# Altium schematic sheet BPBE Module.SchDoc
size C
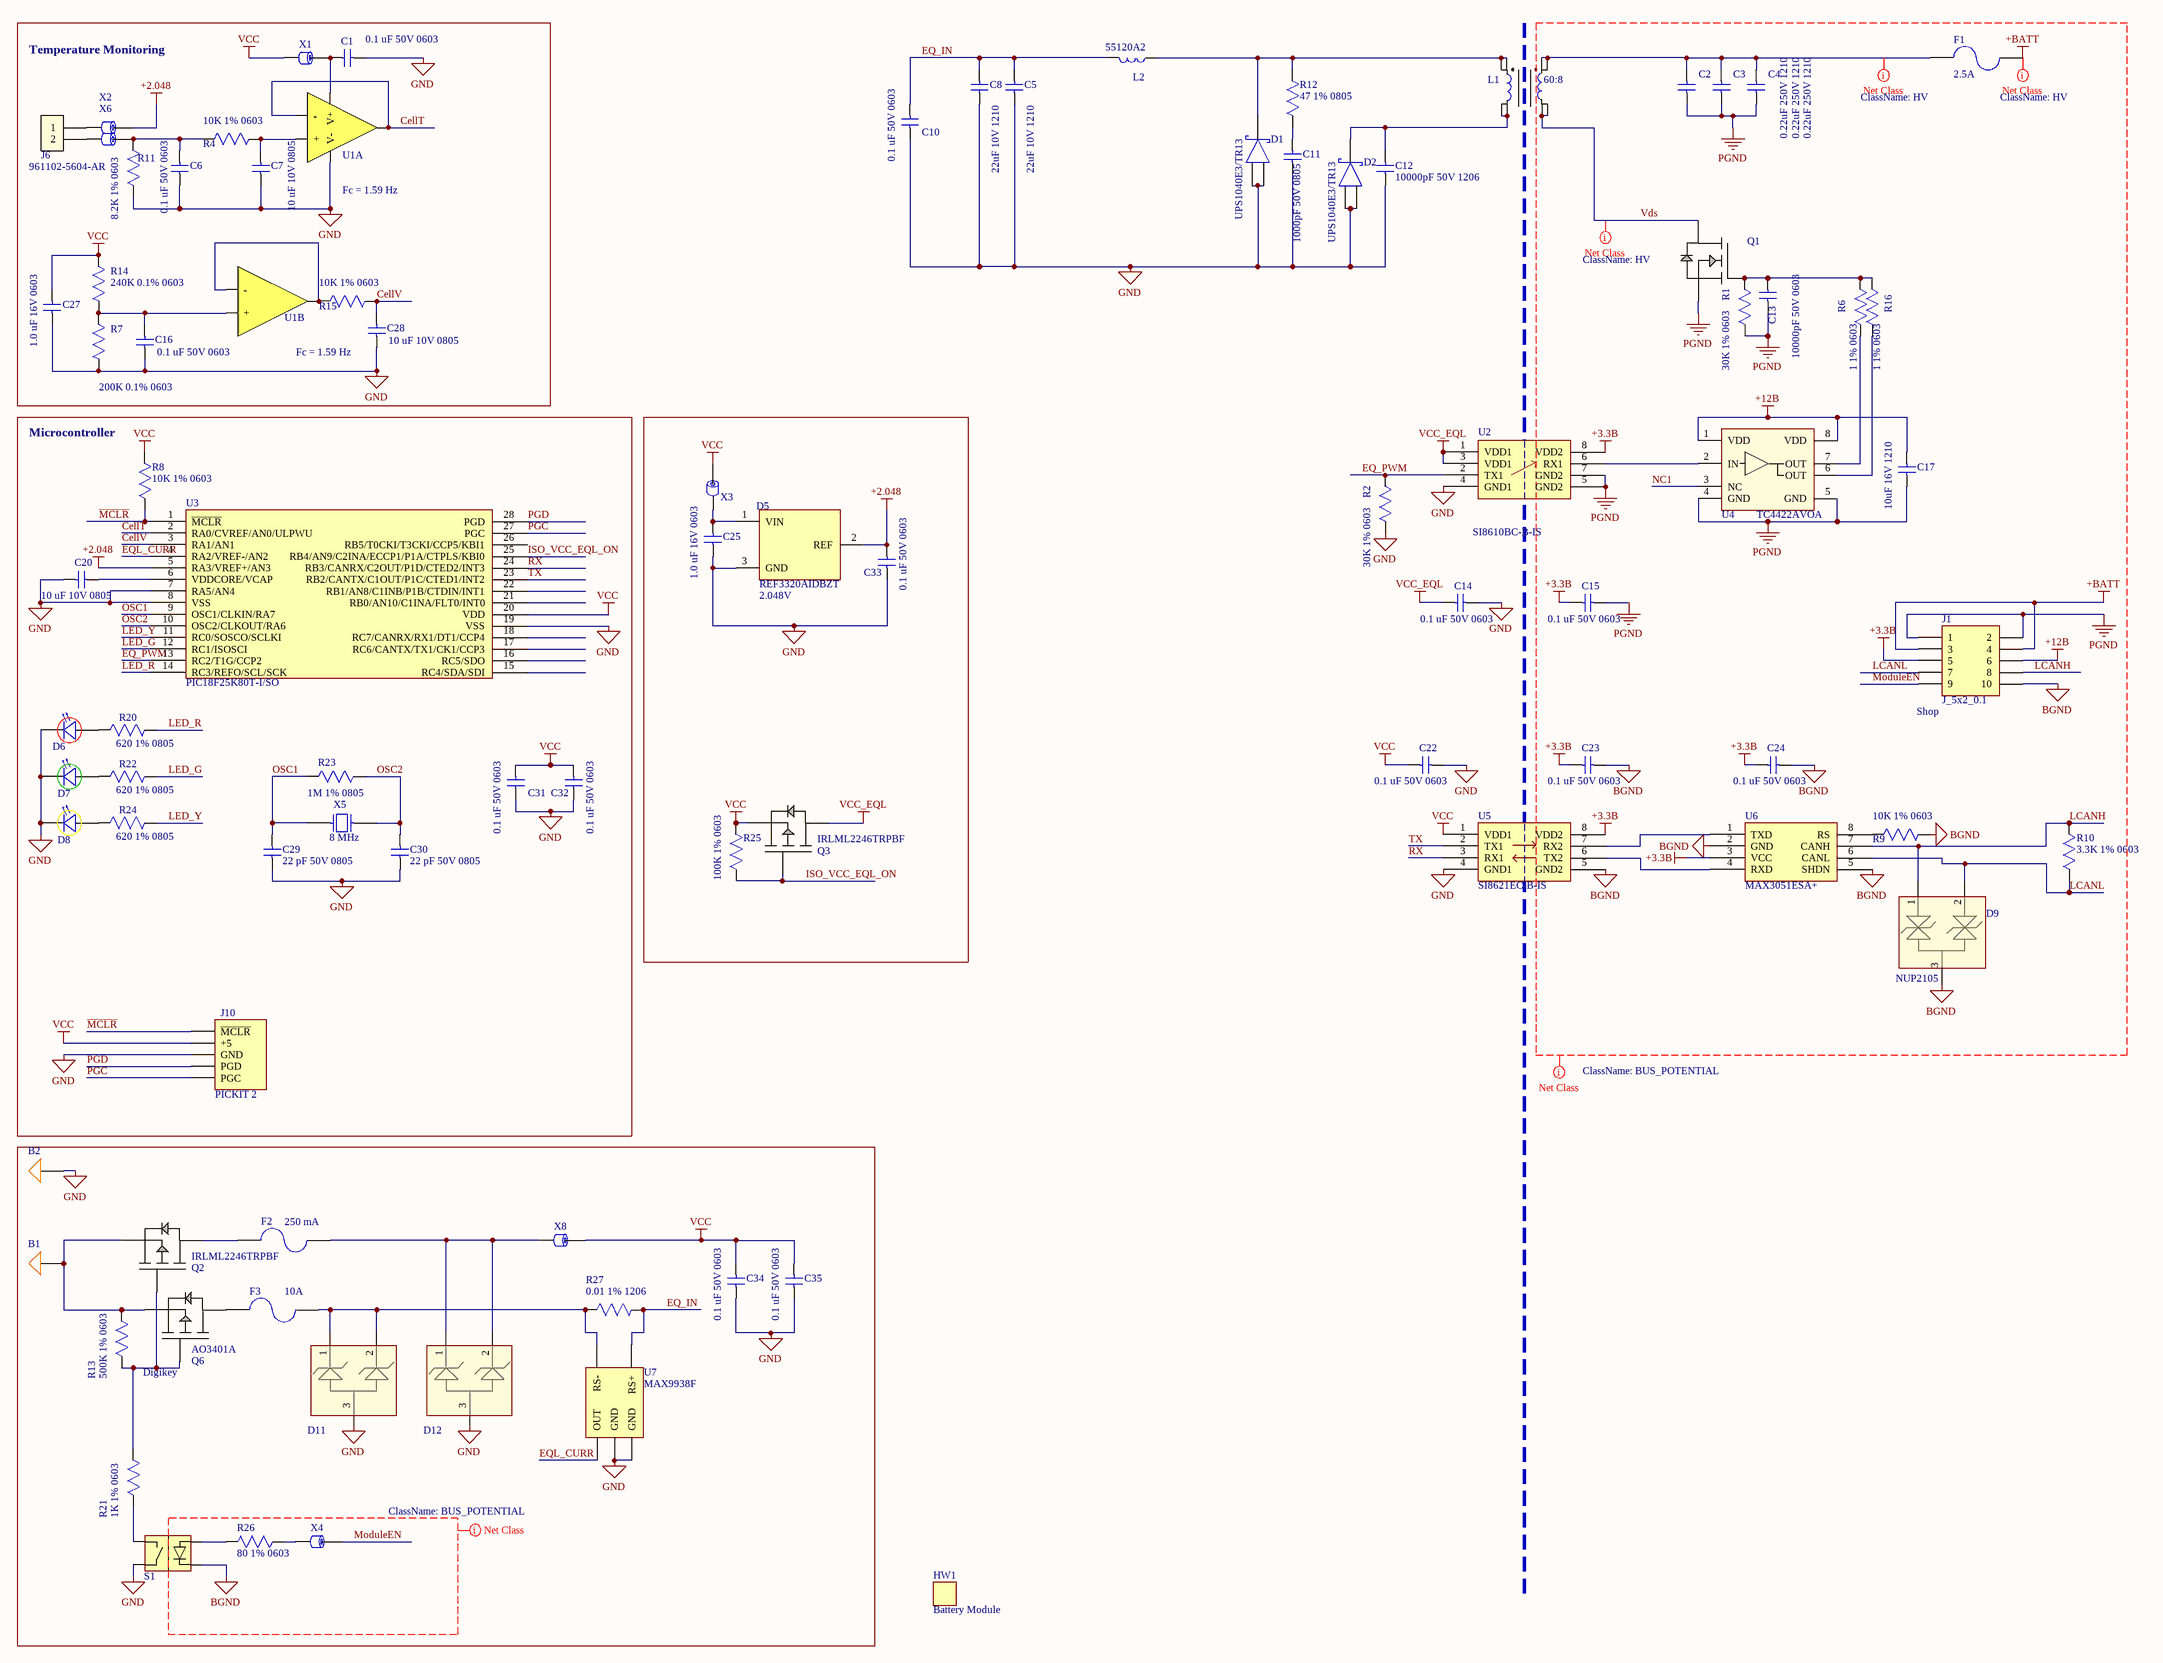
[diagram p0: BPBE Module.SchDoc]

## Parts
B1  J_C3_BATTERY_PAD  [BatteryPad]  (value not drawn)
B2  J_C3_BATTERY_PAD  [BatteryPad]  (value not drawn)
C1  value 0.1 uF 50V 0603  [0603_cap]  (hidden comment: CAP 0603)
C2  value 0.22uF 250V 1210  [1210_Capacitor]  (hidden comment: CAP 1210)
C3  value 0.22uF 250V 1210  [1210_Capacitor]  (hidden comment: CAP CER 0.22UF 250V 20% X7R 1210)
C4  value 0.22uF 250V 1210  [1210_Capacitor]  (hidden comment: CAP 1210)
C5  value 22uF 10V 1210  [1210_Capacitor]  (hidden comment: CAP 1210)
C6  value 0.1 uF 50V 0603  [0603_cap]  (hidden comment: CAP 0603)
C7  value 10 uF 10V 0805  [0805_Capacitor]  (hidden comment: CAP 0805)
C8  value 22uF 10V 1210  [1210_Capacitor]  (hidden comment: CAP 1210)
C10  value 0.1 uF 50V 0603  [0603_cap]  (hidden comment: CAP 0603)
C11  value 1000pF 50V 0805  [0805_Capacitor]  (hidden comment: CAP 1000pF)
C12  value 10000pF 50V 1206  [1206_CAPACITOR]  (hidden comment: CAP 1206)
C13  value 10000pF 50V 0603  [0603_cap]  (hidden comment: CAP 0603)
C14  value 0.1 uF 50V 0603  [0603_cap]  (hidden comment: CAP 0603)
C15  value 0.1 uF 50V 0603  [0603_cap]  (hidden comment: CAP 0603)
C16  value 0.1 uF 50V 0603  [0603_cap]  (hidden comment: CAP 0603)
C17  value 10uF 16V 1210  [1210_Capacitor]  (hidden comment: CAP 1210)
C20  value 10 uF 10V 0805  [0805_Capacitor]  (hidden comment: CAP 0805)
C22  value 0.1 uF 50V 0603  [0603_cap]  (hidden comment: CAP 0603)
C23  value 0.1 uF 50V 0603  [0603_cap]  (hidden comment: CAP 0603)
C24  value 0.1 uF 50V 0603  [0603_cap]  (hidden comment: CAP 0603)
C25  value 1.0 uF 16V 0603  [0603_cap]  (hidden comment: CAP 0603)
C27  value 1.0 uF 16V 0603  [0603_cap]  (hidden comment: CAP 0603)
C28  value 10 uF 10V 0805  [0805_Capacitor]  (hidden comment: CAP 0805)
C29  value 22 pF 50V 0805  [0805_Capacitor]  (hidden comment: CAP 0805)
C30  value 22 pF 50V 0805  [0805_Capacitor]  (hidden comment: CAP 0805)
C31  value 0.1 uF 50V 0603  [0603_cap]  (hidden comment: CAP 0603)
C32  value 0.1 uF 50V 0603  [0603_cap]  (hidden comment: CAP 0603)
C33  value 0.1 uF 50V 0603  [0603_cap]  (hidden comment: CAP 0603)
C34  value 0.1 uF 50V 0603  [0603_cap]  (hidden comment: CAP 0603)
C35  value 0.1 uF 50V 0603  [0603_cap]  (hidden comment: CAP 0603)
D1  UPS1040E3/TR13  [TO-277]
D2  UPS1040E3/TR13  [TO-277]
D5  value 2.048V  Manufacturer PN: REF3320AIDBZT  [SOT-23]  (hidden comment: IC LDO V-REF 2.048V SOT23-3)
D6  D_LED_0805_RED  [0805P_RED]  (value not drawn)
D7  D_LED_0805_GREEN  [0805P_Green]  (value not drawn)
D8  D_LED_0805_YELLOW  [0805P_YELLOW]  (value not drawn)
D9  Manufacturer PN: NUP2105  [SOT-23]  (hidden comment: CAN TVS)
D11  MMBZ6V8AL,215  [SOT-23]  (value not drawn)
D12  MMBZ6V8AL,215  [SOT-23]  (value not drawn)
F1  value 2.5A  [2410]  (hidden comment: F_SSQ 12)
F2  250 mA  [1206_RESISTOR]
F3  value 10A  [2410]  (hidden comment: F_SSQ 10)
HW1  Battery Module  [Battery Module]
J1  J_5x2_0.1  Distributor: Shop  [10PIN_2_.100IN]
J6  Manufacturer PN: 961102-5604-AR  [SIP_HEADER_2]  (hidden comment: J_Thermistor_Connector)
J10  value PICKIT 2  [CONN FEMALE 5POS .100" R/A GOLD]  (hidden comment: J_PICKIT2_5)
L1  value 60:8  [PCB1808B1]  (hidden comment: L_PCB1808B1)
L2  L_MagInc_55120A2  [Magnetics_55120A2]  (value not drawn)
Q1  IPD600N25N3 G  [DPAK - JN]  (value not drawn)
Q2  IRLML2246TRPBF  [SOT-23]
Q3  IRLML2246TRPBF  [SOT-23]
Q6  Manufacturer PN: AO3401A  Distributor: Digikey  [SOT-23]  (hidden comment: Q_AO3401A)
R1  value 30K 1% 0603  [0603_res]  (hidden comment: RES 0603)
R2  value 30K 1% 0603  [0603_res]  (hidden comment: RES 0603)
R4  value 10K 1% 0603  [0603_res]  (hidden comment: RES 0603)
R6  value 1 1% 0603  [0603_res]  (hidden comment: RES 0603)
R7  value 200K 0.1% 0603  [0603_res]  (hidden comment: RES 0603)
R8  value 10K 1% 0603  [0603_res]  (hidden comment: RES 0603)
R9  value 10K 1% 0603  [0603_res]  (hidden comment: RES 0603)
R10  value 3.3K 1% 0603  [0603_res]  (hidden comment: RES 0603)
R11  value 8.2K 1% 0603  [0603_res]  (hidden comment: RES 0603)
R12  value 47 1% 0805  [0805_Resistor]  (hidden comment: RES 0805)
R13  value 500K 1% 0603  [0603_res]  (hidden comment: RES 0603)
R14  value 240K 0.1% 0603  [0603_res]  (hidden comment: RES 0603)
R15  value 10K 1% 0603  [0603_res]  (hidden comment: RES 0603)
R16  value 1 1% 0603  [0603_res]  (hidden comment: RES 0603)
R20  value 620 1% 0805  [0805_Resistor]  (hidden comment: R_0805_620_1%)
R21  value 1K 1% 0603  [0603_res]  (hidden comment: RES 0603)
R22  value 620 1% 0805  [0805_Resistor]  (hidden comment: R_0805_620_1%)
R23  value 1M 1% 0805  [0805_Resistor]  (hidden comment: RES 0805)
R24  value 620 1% 0805  [0805_Resistor]  (hidden comment: R_0805_620_1%)
R25  value 100K 1% 0603  [0603_res]  (hidden comment: RES 0603)
R26  value 80 1% 0603  [0603_res]  (hidden comment: RES 0603)
R27  value 0.01 1% 1206  [1206_Resistor]  (hidden comment: R_0805_0.01_1%)
S1  CPC1017NTR  [CPC1017NTR]  (value not drawn)
U1  IC OP AMP  [SOIC127P600X175-8N]  (value not drawn)  (parts A,B of 2)
U2  Manufacturer PN: SI8610BC-B-IS  [SOIC127P600X175-8N]  (hidden comment: U_SI8610EC)
U3  Manufacturer PN: PIC18F25K80T-I/SO  [SOIC127P1030X265-28N]  (hidden comment: PIC18F25K80)
U4  TC4422AVOA  [SOIC127P600X175-8N]
U5  Manufacturer PN: SI8621EC-B-IS  [SOIC127P600X175-8N]  (hidden comment: U_SI8621EC)
U6  Manufacturer PN: MAX3051ESA+  [SOIC127P600X175-8N]  (hidden comment: U_MAX3051)
U7  value MAX9938F  [SOT95P280X145-5N]  (hidden comment: U_ MAX9938F)
X1  0603  [0603_res]  (value not drawn)
X2  0603  [0603_res]  (value not drawn)
X3  0603  [0603_res]  (value not drawn)
X4  0603  [0603_res]  (value not drawn)
X5  value 8 MHz  [HC-49]  (hidden comment: HC49)
X6  0603  [0603_res]  (value not drawn)
X8  0603  [0603_res]  (value not drawn)

## Blocks framed on the sheet
Temperature Monitoring: C1 C6 C7 C16 C27 C28 J6 R4 R7 R11 R14 R15 U1 X1 X2 X6
Microcontroller: C20 C29-C32 D6-D8 J10 R8 R20 R22-R24 U3 X5

## Nets
+2.048: C33.1 D5.2(REF) U3.5(RA3/VREF+/AN3) X2.2
+3.3B: C15.1 C23.1 C24.1 J1.5 U2.8(VDD2) U5.8(VDD2) U6.3(VCC)
+12B: C17.1 J1.6 U4.1(VDD) U4.8(VDD)
+BATT: F1.1 J1.3 J1.4
BGND: C23.2 C24.2 D9.3 J1.10 R9.1 S1.2 U5.5(GND2) U6.2(GND) U6.5(SHDN)
GND: B2.1 C1.2 C5.2 C6.2 C7.2 C8.2 C10.2 C11.2 C12.2 C14.2 C16.2 C20.2 C22.2 C25.2 C27.2 C28.2 C29.2 C30.2 C31.2 C32.2 C33.2 C34.2 C35.2 D1.1 D1.2 D2.1 D2.2 D5.3(GND) D6.1(Cathode) D7.1(Cathode) D8.1(Cathode) D11.3 D12.3 J10.GND R2.2 R7.2 R11.2 S1.3 U1.4(V-) U2.4(GND1) U3.7(RA5/AN4) U3.8(VSS) U3.19(VSS) U5.4(GND1) U7.1(GND) U7.2(GND)
PGND: C2.2 C3.2 C4.2 C13.1 C15.2 C17.2 J1.1 J1.2 Q1.3(SOURCE) R1.2 U2.5(GND2) U2.7(GND2) U4.4(GND) U4.5(GND)
VCC: C22.1 C27.1 C31.1 C32.1 C34.1 C35.1 J10.+5 Q3.2(SOURCE) R8.1 R14.1 R25.1 U3.20(VDD) U5.1(VDD1) X1.1 X3.2 X8.2
VCC_EQL: C14.1 Q3.3(DRAIN) U2.1(VDD1) U2.3(VDD1)
CellT: U1.1(Vo) U1.2(-) U3.2(RA0/CVREF/AN0/ULPWU)
CellV: C28.1 R15.1 U3.3(RA1/AN1)
EQ_IN: C5.1 C8.1 C10.1 L2.2 R27.1 U7.5(RS+)
EQ_PWM: R2.1 U2.2(TX1) U3.13(RC2/T1G/CCP2)
EQL_CURR: U3.4(RA2/VREF-/AN2) U7.3(OUT)
ISO_VCC_EQL_ON: Q3.1(GATE) R25.2 U3.25(RB4/AN9/C2INA/ECCP1/P1A/CTPLS/KBI0)
LCANH: D9.1 J1.8 R10.1 U6.7(CANH)
LCANL: D9.2 J1.7 R10.2 U6.6(CANL)
LED_G: R22.1 U3.12(RC1/ISOSCI)
LED_R: R20.1 U3.14(RC3/REFO/SCL/SCK)
LED_Y: R24.1 U3.11(RC0/SOSCO/SCLKI)
~{MCLR}: J10.RST(~{MCLR}) R8.2 U3.1(~{MCLR})
ModuleEN: J1.9 X4.2
NC1: U4.3(NC)
OSC1: C29.1 R23.2 U3.9(OSC1/CLKIN/RA7) X5.2
OSC2: C30.1 R23.1 U3.10(OSC2/CLKOUT/RA6) X5.1
PGC: J10.PGC U3.27(PGC)
PGD: J10.PGD U3.28(PGD)
RX: U3.24(RB3/CANRX/C2OUT/P1D/CTED2/INT3) U5.3(RX1)
TX: U3.23(RB2/CANTX/C1OUT/P1C/CTED1/INT2) U5.2(TX1)
Vds: L1.7 L1.8 Q1.2(DRAIN)
NetB1_1: B1.1 Q2.2(SOURCE) Q6.2(SOURCE) R13.1
NetC1_1: C1.1 U1.8(V+) X1.2
NetC2_1: C2.1 C3.1 C4.1 F1.2 L1.1 L1.2
NetC6_1: C6.1 R4.2 R11.1 X6.2
NetC7_1: C7.1 R4.1 U1.3(+)
NetC11_1: C11.1 R12.2
NetC12_1: C12.1 D2.K L1.5 L1.6
NetC13_2: C13.2 Q1.1(GATE) R1.1 R6.1 R16.1
NetC16_1: C16.1 R7.1 R14.2 U1.5(+)
NetC20_1: C20.1 U3.6(VDDCORE/VCAP)
NetC25_1: C25.1 D5.1(VIN) X3.1
NetD1_K: D1.K L1.3 L1.4 L2.1 R12.1
NetD6_2: D6.2(Anode) R20.2
NetD7_2: D7.2(Anode) R22.2
NetD8_2: D8.2(Anode) R24.2
NetD11_1: D11.1 D11.2 F3.1 R27.2 U7.4(RS-)
NetD12_1: D12.1 D12.2 F2.2 X8.1
NetF2_1: F2.1 Q2.3(DRAIN)
NetF3_2: F3.2 Q6.3(DRAIN)
NetJ6_1: J6.1 X2.1
NetJ6_2: J6.2 X6.1
NetQ2_1: Q2.1(GATE) Q6.1(GATE) R13.2 R21.1
NetR6_2: R6.2 U4.7(OUT)
NetR9_2: R9.2 U6.8(RS)
NetR15_2: R15.2 U1.6(-) U1.7(Vo)
NetR16_2: R16.2 U4.6(OUT)
NetR21_2: R21.2 S1.4
NetR26_1: R26.1 S1.1
NetR26_2: R26.2 X4.1
NetU2_6: U2.6(RX1) U4.2(IN)
NetU5_6: U5.6(TX2) U6.4(RXD)
NetU5_7: U5.7(RX2) U6.1(TXD)

Not connected (* = marked no-connect by the designer): U3 15(RC4/SDA/SDI) 16(RC5/SDO) 17(RC6/CANTX/TX1/CK1/CCP3) 18(RC7/CANRX/RX1/DT1/CCP4) 21(RB0/AN10/C1INA/FLT0/INT0) 22(RB1/AN8/C1INB/P1B/CTDIN/INT1) 26(RB5/T0CKI/T3CKI/CCP5/KBI1)

## Layout directives
net class BUS_POTENTIAL: +3.3B, +12B, +BATT, BGND, LCANH, LCANL, ModuleEN, NC1, PGND, Vds
net class HV: +BATT, NetC2_1, Vds

## Notes on the sheet
- (near U1) Fc = 1.59 Hz
- Fc = 1.59 Hz

## Library data of the parts
C1 C6 C10 C14-C16 C22-C24 C31-C35 = C_0603: CAP CER 0.1UF 50V 10% X7R 0603; Manufacturer: Yaego; Manufacturer PN: CC0603KRX7R9BB104; Distributor: Digikey
C2 C4 = C_1210: CAP CER 0.22UF 250V 20% X7R 1210; Manufacturer: TDK Corporation; Manufacturer PN: C3225X7R2E224M; Distributor: Digikey
C3 = C_1210: Manufacturer: TDK Corporation; Manufacturer PN: C3225X7R2E224M; Distributor: Digikey
C5 C8 = C_1210: CAP CER 22UF 10V 10% X7R 1210; Manufacturer: TDK Corporation; Manufacturer PN: C3225X7R1A226K/2.30; Distributor: Digikey
C7 C20 C28 = C_0805: CAP CER 10UF 10V 10% X5R 0805; Manufacturer: Taiyo Yuden; Manufacturer PN: LMK212BJ106KG-T; Distributor: Digikey
C11 = C_0805_1000pF: CAP CER 1000PF 50V 10% NP0 0805; Manufacturer: Johanson Dielectrics Inc; Manufacturer PN: 500R15W102KV4T; Distributor: Digikey
C12 = C_1206: CAP CERM 1206; Known Distributors: Digikey; Package: 1206
C13 = C_0603: CAP CER 10000PF 50V 10% X7R 0603; Manufacturer: Yageo; Manufacturer PN: CC0603KRX7R9BB103; Distributor: Digikey
C17 = C_1210: CAP CER 10UF 16V 10% X5R 1210; Manufacturer: Taiyo Yuden; Manufacturer PN: EMK325BJ106KN-T; Distributor: Digikey
C25 C27 = C_0603: CAP CER 1UF 16V 10% X7R 0603; Manufacturer: Taiyo Yuden; Manufacturer PN: EMK107B7105KA-T; Distributor: Digikey
C29 C30 = C_0805: CAP CER 22PF 50V 5% NP0 0805; Manufacturer: Johanson Dielectrics Inc; Manufacturer PN: 500R15N220JV4T; Distributor: Digikey
D1 D2 = D_UPS1040E3/TR13: DIODE SCHOTTKY 10A 40V PWRMITE3; Manufacturer: Microsemi; Distributor: Digikey; Manufacturer PN: UPS1040E3/TR13
D5 = D_REF3320AIDBZT: Manufacturer: TI; Distributor: Digi-Key
D6 = D_LED_0805_RED: LED 2X1.2MM 625NM RD WTR CLR SMD 0805; Manufacturer: Kingbright Corp; Manufacturer PN: APT2012EC; Distributor: Digikey
D7 = D_LED_0805_GREEN: LED 2X1.2MM 568NM GN WTR CLR SMD 0805; Manufacturer: Kingbright Corp; Manufacturer PN: APT2012SGC; Distributor: Digikey
D8 = D_LED_0805_YELLOW: LED 2X1.2MM 588NM YW WTR CLR SMD 0805; Manufacturer: Kingbright Corp; Manufacturer PN: APT2012YC; Distributor: Digikey
D9 = D_NUP2105: IC CAN BUS PROTECTOR DUAL SOT23; Manufacturer: ON Semiconductor; Distributor: Digikey
D11 D12 = D_MMBZ6V8AL,215: DIODE ESD PROT DBL 4.5V SOT23; Manufacturer: NXP; Manufacturer PN: MMBZ6V8AL,215; Distributor: Digikey
F1 = F_SSQ 12: FUSE 2.5A 125V FAST 2410; Manufacturer PN: 2410SFV2.50FM/125-2; Manufacturer: TE Connectivity; Distributor: Digikey
F2 = F_250mA_1206: FUSE 250MA 125V 1206 FAST C1Q; Manufacturer PN: C1Q 250; Manufacturer: Bel Fuse Inc; Distributor: Digikey
F3 = F_SSQ 12: FUSE 10A 125V 6125 FAST SSQ; Manufacturer PN: SSQ 10; Manufacturer: Bel Fuse Inc; Distributor: Digikey
J1 = J_5x2_0.1: 5 x 2 0.1" Header
J6 = J_Thermistor_Connector: Thermistor Connector; Manufacturer: 3M; Distributor: Digikey
J10 = J_PICKIT2_5: PICKIT2 PROG HEADER; Manufacturer: Sullins Connector Solutions; Manufacturer PN: PPPC051LGBN-RC; Distributor: Digikey
L1 = L_PCB1808B1: 10:1 Custom Transformer; Manufacturer: Magnetics, Inc.; Manufacturer PN: PCB1808B1/0F41808EC; Distributor: MTL
L2 = L_MagInc_55120A2: 55120A2; Manufacturer: Magnetics Inc; Manufacturer PN: 55120A2; Distributor: MTL
Q1 = Q_IPD600N25N3 G: MOSFET N-CH 250V 25A TO252-3; Manufacturer: Infineon; Gate Charge: 29nC; Distributor: Digikey; Manufacturer PN: IPD600N25N3 G; ComponentLink1Description: http://search.digikey.com/scripts/DkSearch/dksus.dll?Detail&name=IRFR4620TRLPBFCT-ND; Current: 25A
Q2 Q3 = Q_FDN302P: MOSFET P-CH 20V 2.6A SOT23; Manufacturer: International Rectifier; Distributor: Digikey; Manufacturer PN: IRLML2246TRPBF; Value: IRLML2246TRPBF
Q6 = Q_AO3401A: MOSFET P-CH -30V -4.3A SOT23; Manufacturer: Alpha & Omega
R1 R2 = R_0603: RESISTOR, 1/10W, 30K, 1%, 0603; Manufacturer: ANY / EQUIV; Known Distributors: Digikey
R4 R8 R9 R15 = R_0603: RESISTOR, 1/10W, 10K, 1%, 0603; Manufacturer: ANY / EQUIV; Known Distributors: Digikey
R6 R16 = R_0603: RESISTOR, 1/10W, 1, 1%, 0603; Manufacturer: ANY / EQUIV; Known Distributors: Digikey
R7 = R_0603: RESISTOR, 1/10W, 200K, 0.1%, 0603; Manufacturer: ANY / EQUIV; Distributor: Digikey
R10 = R_0603: RESISTOR, 1/10W, 3.3K, 1%, 0603; Manufacturer: ANY / EQUIV; Known Distributors: Digikey
R11 = R_0603: RESISTOR, 1/10W, 8.2K, 1%, 0603; Manufacturer: ANY / EQUIV; Distributor: Digikey
R12 = R_0805: RESISTOR, 1/8W, 47, 1%, 0805; Manufacturer: ANY / EQUIV; Known Distributors: Digikey; Package: 0805
R13 = R_0603: RESISTOR, 1/10W, 500K, 1%, 0603; Manufacturer: ANY / EQUIV; Known Distributors: Digikey
R14 = R_0603: RESISTOR, 1/10W, 240K, 0.1%, 0603; Manufacturer: ANY / EQUIV; Distributor: Digikey; Package: 0603
R20 R22 R24 = R_0805_620_1%: RESISTOR, 1/8W, 620, 1%, 0805; Manufacturer: ANY / EQUIV; Distributor: Digikey
R21 = R_0603: RESISTOR, 1/10W, 1K, 1%, 0603; Manufacturer: ANY / EQUIV; Known Distributors: Digikey
R23 = R_0805: RESISTOR, 1/8W, 1M, 1%, 0805; Manufacturer: ANY / EQUIV; Known Distributors: Digikey; Package: 0805
R25 = R_0603: RESISTOR, 1/10W, 100K, 1%, 0603; Manufacturer: ANY / EQUIV; Known Distributors: Digikey
R26 = R_0603: RESISTOR, 1/10W, 80, 1%, 0603; Manufacturer: ANY / EQUIV; Known Distributors: Digikey
R27 = R_0805_0.01_1%: RES CURRENT SENSE .010 OHM 1W 1%; Manufacturer PN: Ohmite; Manufacturer: MCS1632R010FER; Distributor: Digikey
S1 = U_CPC1017NTR: PHOTOCPLR RELAY MOSFET-OUT 4-SOP; Manufacturer: Clare; Distributor: Digikey; Manufacturer PN: CPC1017NTR
U1 = U_MCP6042T-I/SN: IC OPAMP 1UA 1.4V DUAL R-R 8SOIC; Manufacturer: Microchip; SVP Creator: Jonathan Nutzmann; Package: 8-SOIC; Distributor: Digikey; Manufacturer PN: MCP6042T-I/SN; ComponentLink1Description: Datasheet; ComponentLink1URL: SVN Datasheet URL; Price: 0.97
U2 = U_SI8610EC: IC ISOLATOR 1CH 3.75KV 8-SOIC; Manufacturer: Silicon Labs; Distributor: Digikey
U3 = U_PIC18F25K80: MCU PIC 32KB FLASH 28SOIC; Manufacturer: Microchip; Distributor: Microchip Donation
U4 = U_TC4422AVOA: IC MOSFET DVR 9A NON-INV 8SOIC; Manufacturer: Microchip; Distributor: Digikey; Manufacturer PN: TC4422AVOA
U5 = U_SI8621EC: IC ISOLATOR 2CH 3.75KV 8SOIC; Manufacturer: Silicon Labs; Distributor: Digikey
U6 = U_MAX3051: IC TXRX CAN 1MBPS 8-SOIC 3.3V; Manufacturer: Maxim; Distributor: Digikey
U7 = U_ MAX9938F: IC AMP CURRENT SENSE SOT23-5; Manufacturer: Maxim; Manufacturer PN: MAX9938FEUK+T; Gain: 50; Distributor: Digikey
X1-X4 X6 X8 = X_0603_FERRITE: FERRITE CHIP 2A 300 OHM SMD; Manufacturer: Laird-Signal Integrity Products; Manufacturer PN: MI0603L301R-10; Value: 300 Ohm @ 100MHz; Distributor: Digikey; Package: 0603
X5 = X_HC49: CRYSTAL 8.00 MHZ 20PF 49US; Manufacturer: ECS; Manufacturer PN: ECS-80-20-4X; Distributor: Digikey/Shop?
B1 B2 = J_C3_BATTERY_PAD: ComponentLink1Description: Datasheet
  B1: HelpURL: n/a
  B2: Distributor: n/a
HW1 = Battery Module: Distributor: n/a